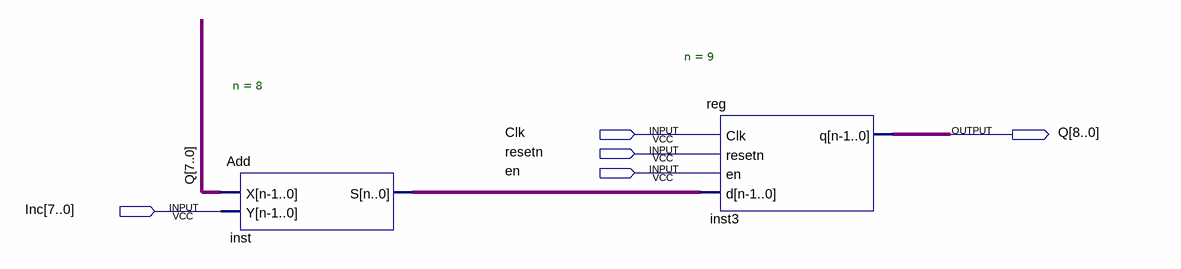
[diagram p0: schematic sheet]
// Quartus schematic EjemploFF.bdf as structural Verilog: 2 symbols, 5 pins
module EjemploFF (
  input  Clk,
  input  resetn,
  input  en,
  input  [7:0] Inc,
  output [8:0] Q
);

  wire [8:0] inst_s;

  Add #(.n(8)) inst (.X(Q[7:0]), .Y(Inc), .S(inst_s));
  \reg  #(.n(9)) inst3 (.Clk(Clk), .resetn(resetn), .en(en), .d(inst_s), .q(Q));
endmodule
